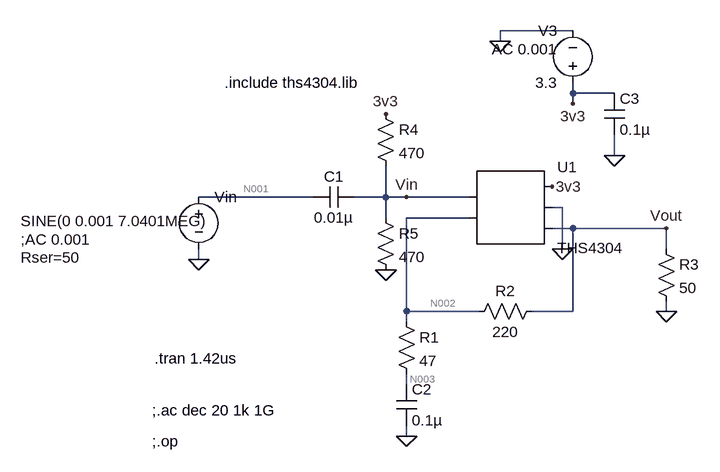
[diagram p0: schematic RF_amp_subcircuit.asc]
* RF_amp_subcircuit.asc
* U1: THS4304 (symbol AutoGenerated\THS4304 not available, pins judged from their places): pin1=Vin pin2=N002 pin3=3v3 pin4=0 pin5=Vout
R1 N002 N003 47
R2 Vout N002 220
R3 Vout 0 50
Vin N001 0 SINE(0 0.001 7.0401MEG) ;AC 0.001 Rser=50
V3 3v3 0 3.3 AC 0.001
R4 3v3 Vin 470
R5 Vin 0 470
C1 Vin N001 0.01µ
C2 N003 0 0.1µ
C3 3v3 0 0.1µ
.include ths4304.lib
.tran 1.42us
;.ac dec 20 1k 1G
;.op
.backanno
.end

* Results of the author's LTspice run, read from the files saved beside the schematic
* Operating Point, zero values left out:
*   V(n002) = 1.651 V
*   V(vin) = 1.652 V
*   V(3v3) = 3.3 V
*   V(vout) = 1.65 V
*   V(n003) = 1.651 V
*   I(R5) = 3.514 mA
*   I(R4) = 3.507 mA
*   I(R3) = 32.99 mA
*   I(R2) = -6.755 µA
*   I(V3) = -45.94 mA
*   Ix(u1:IN+) = -7.245 µA
*   Ix(u1:IN-) = -6.755 µA
*   Ix(u1:VS+) = 42.44 mA
*   Ix(u1:VS-) = -9.453 mA
*   Ix(u1:OUT) = -32.99 mA
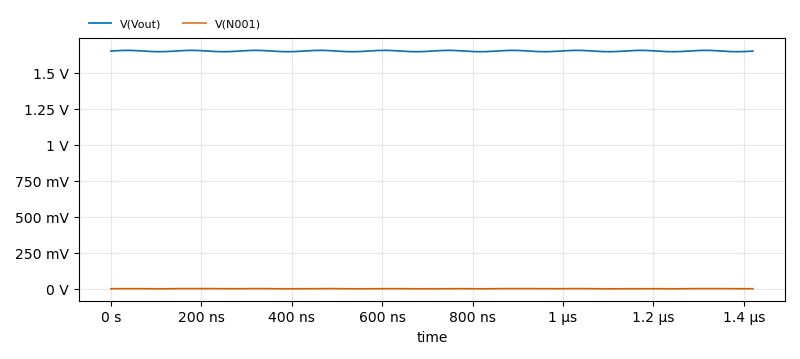
[diagram p1: Transient Analysis of RF_amp_subcircuit.asc, plotted from the saved traces]
* Transient Analysis, 1 run:
*   V(Vout): min 1.645 V, max 1.654 V, average 1.65 V, rms 1.65 V, last 1.649 V
*   V(N001): min -823.6 µV, max 825.9 µV, average 1.338 µV, rms 583.3 µV, last -18.8 µV